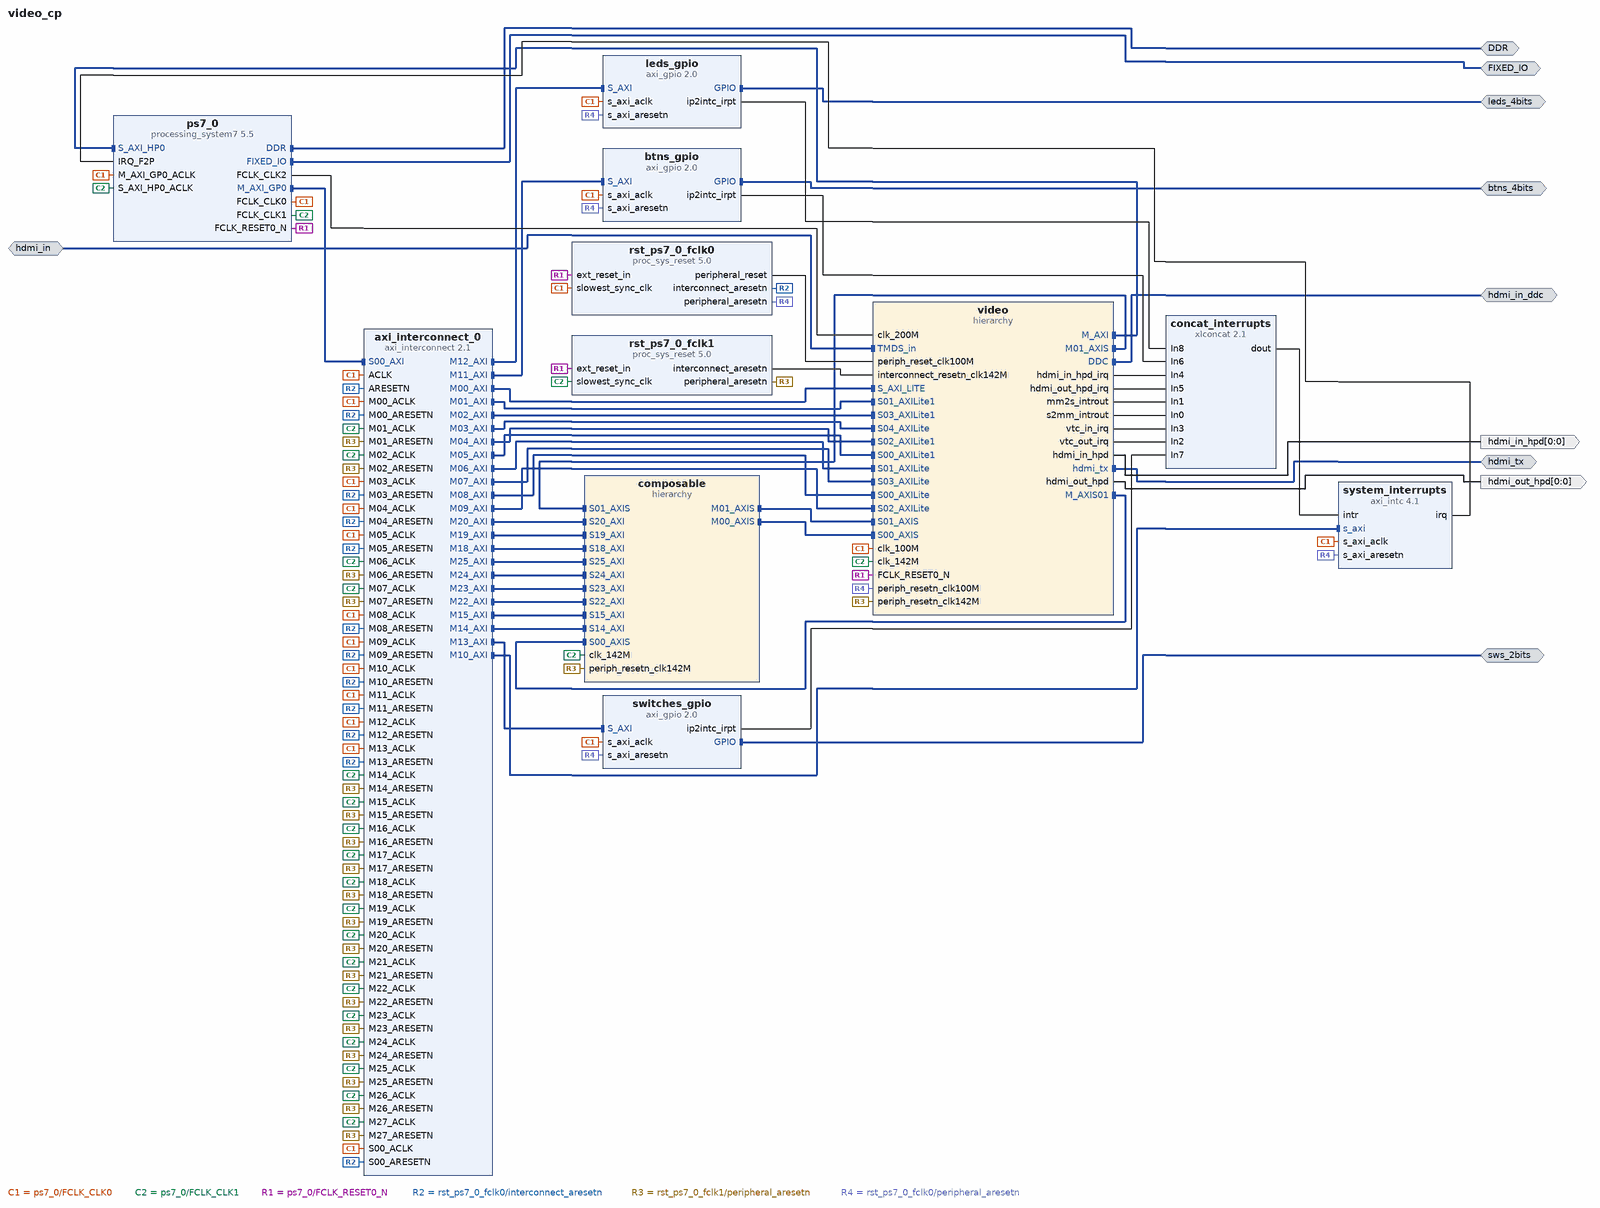
[diagram p0: block diagram of the top level]
# Vivado block design video_cp, xc7z020clg400-1, Vivado 2020.2.2
create_bd_design video_cp

create_bd_intf_port -mode Master -vlnv xilinx.com:interface:ddrx_rtl:1.0 DDR
create_bd_intf_port -mode Master -vlnv xilinx.com:display_processing_system7:fixedio_rtl:1.0 FIXED_IO
create_bd_intf_port -mode Master -vlnv xilinx.com:interface:gpio_rtl:1.0 btns_4bits
create_bd_intf_port -mode Slave -vlnv digilentinc.com:interface:tmds_rtl:1.0 hdmi_in
create_bd_intf_port -mode Master -vlnv xilinx.com:interface:iic_rtl:1.0 hdmi_in_ddc
create_bd_intf_port -mode Master -vlnv xilinx.com:interface:hdmi_rtl:2.0 hdmi_tx
create_bd_intf_port -mode Master -vlnv xilinx.com:interface:gpio_rtl:1.0 leds_4bits
create_bd_intf_port -mode Master -vlnv xilinx.com:interface:gpio_rtl:1.0 sws_2bits
create_bd_port -dir O -from 0 -to 0 hdmi_in_hpd
create_bd_port -dir O -from 0 -to 0 hdmi_out_hpd

create_bd_cell -type ip -vlnv xilinx.com:ip:axi_interconnect:2.1 axi_interconnect_0
set_property -dict [list \
  CONFIG.M00_HAS_REGSLICE 1 \
  CONFIG.M01_HAS_REGSLICE 1 \
  CONFIG.M02_HAS_REGSLICE 1 \
  CONFIG.M03_HAS_REGSLICE 1 \
  CONFIG.M04_HAS_REGSLICE 1 \
  CONFIG.M05_HAS_REGSLICE 1 \
  CONFIG.M06_HAS_REGSLICE 1 \
  CONFIG.M07_HAS_REGSLICE 1 \
  CONFIG.M08_HAS_REGSLICE 1 \
  CONFIG.M09_HAS_REGSLICE 1 \
  CONFIG.NUM_MI 28 \
  CONFIG.S00_HAS_REGSLICE 1 \
] [get_bd_cells axi_interconnect_0]
create_bd_cell -type ip -vlnv xilinx.com:ip:axi_gpio:2.0 btns_gpio
set_property -dict {CONFIG.C_ALL_INPUTS 1 CONFIG.C_GPIO_WIDTH 4 CONFIG.C_INTERRUPT_PRESENT 1} [get_bd_cells btns_gpio]
create_bd_cell -type hier composable
create_bd_cell -type ip -vlnv xilinx.com:ip:axi_gpio:2.0 leds_gpio
set_property -dict [list \
  CONFIG.C_ALL_OUTPUTS 1 \
  CONFIG.C_GPIO_WIDTH 4 \
  CONFIG.C_INTERRUPT_PRESENT 1 \
  CONFIG.C_IS_DUAL 0 \
] [get_bd_cells leds_gpio]
create_bd_cell -type ip -vlnv xilinx.com:ip:processing_system7:5.5 ps7_0
set_property -dict [list \
  CONFIG.PCW_APU_PERIPHERAL_FREQMHZ 650 \
  CONFIG.PCW_CRYSTAL_PERIPHERAL_FREQMHZ 50 \
  CONFIG.PCW_ENET0_ENET0_IO {MIO 16 .. 27} \
  CONFIG.PCW_ENET0_GRP_MDIO_ENABLE 1 \
  CONFIG.PCW_ENET0_GRP_MDIO_IO {MIO 52 .. 53} \
  CONFIG.PCW_ENET0_PERIPHERAL_ENABLE 1 \
  CONFIG.PCW_EN_CLK1_PORT 1 \
  CONFIG.PCW_EN_CLK2_PORT 1 \
  CONFIG.PCW_FCLK_CLK1_BUF TRUE \
  CONFIG.PCW_FCLK_CLK2_BUF TRUE \
  CONFIG.PCW_FPGA0_PERIPHERAL_FREQMHZ 100 \
  CONFIG.PCW_FPGA1_PERIPHERAL_FREQMHZ 142 \
  CONFIG.PCW_FPGA2_PERIPHERAL_FREQMHZ 200 \
  CONFIG.PCW_FPGA3_PERIPHERAL_FREQMHZ 100 \
  CONFIG.PCW_FPGA_FCLK1_ENABLE 1 \
  CONFIG.PCW_FPGA_FCLK2_ENABLE 1 \
  CONFIG.PCW_GPIO_MIO_GPIO_ENABLE 0 \
  CONFIG.PCW_I2C0_GRP_INT_ENABLE 1 \
  CONFIG.PCW_I2C0_GRP_INT_IO EMIO \
  CONFIG.PCW_I2C0_I2C0_IO {MIO 50 .. 51} \
  CONFIG.PCW_I2C0_PERIPHERAL_ENABLE 1 \
  CONFIG.PCW_I2C_PERIPHERAL_FREQMHZ 108.333336 \
  CONFIG.PCW_IRQ_F2P_INTR 1 \
  CONFIG.PCW_PERIPHERAL_BOARD_PRESET None \
  CONFIG.PCW_PRESET_BANK1_VOLTAGE {LVCMOS 1.8V} \
  CONFIG.PCW_QSPI_GRP_FBCLK_ENABLE 1 \
  CONFIG.PCW_QSPI_GRP_FBCLK_IO {MIO 8} \
  CONFIG.PCW_QSPI_GRP_SINGLE_SS_ENABLE 1 \
  CONFIG.PCW_QSPI_GRP_SINGLE_SS_IO {MIO 1 .. 6} \
  CONFIG.PCW_QSPI_PERIPHERAL_ENABLE 1 \
  CONFIG.PCW_QSPI_QSPI_IO {MIO 1 .. 6} \
  CONFIG.PCW_SD0_GRP_CD_ENABLE 1 \
  CONFIG.PCW_SD0_GRP_CD_IO {MIO 47} \
  CONFIG.PCW_SD0_GRP_WP_ENABLE 0 \
  CONFIG.PCW_SD0_PERIPHERAL_ENABLE 1 \
  CONFIG.PCW_SD0_SD0_IO {MIO 40 .. 45} \
  CONFIG.PCW_SDIO_PERIPHERAL_FREQMHZ 50 \
  CONFIG.PCW_SINGLE_QSPI_DATA_MODE x4 \
  CONFIG.PCW_UART0_PERIPHERAL_ENABLE 1 \
  CONFIG.PCW_UART0_UART0_IO {MIO 14 .. 15} \
  CONFIG.PCW_UART1_PERIPHERAL_ENABLE 0 \
  CONFIG.PCW_UART_PERIPHERAL_FREQMHZ 100 \
  CONFIG.PCW_UIPARAM_DDR_BUS_WIDTH {16 Bit} \
  CONFIG.PCW_UIPARAM_DDR_FREQ_MHZ 525 \
  CONFIG.PCW_UIPARAM_DDR_PARTNO Custom \
  CONFIG.PCW_USB0_PERIPHERAL_ENABLE 1 \
  CONFIG.PCW_USB0_USB0_IO {MIO 28 .. 39} \
  CONFIG.PCW_USE_FABRIC_INTERRUPT 1 \
  CONFIG.PCW_USE_S_AXI_HP0 1 \
] [get_bd_cells ps7_0]
# 481 more settings of ps7_0 are not shown: defaults, MIO pin electricals, DDR timing, and values the tool derives
create_bd_cell -type ip -vlnv xilinx.com:ip:proc_sys_reset:5.0 rst_ps7_0_fclk0
create_bd_cell -type ip -vlnv xilinx.com:ip:proc_sys_reset:5.0 rst_ps7_0_fclk1
create_bd_cell -type ip -vlnv xilinx.com:ip:axi_gpio:2.0 switches_gpio
set_property -dict [list \
  CONFIG.C_ALL_INPUTS 1 \
  CONFIG.C_GPIO_WIDTH 2 \
  CONFIG.C_INTERRUPT_PRESENT 1 \
  CONFIG.C_IS_DUAL 0 \
] [get_bd_cells switches_gpio]
create_bd_cell -type ip -vlnv xilinx.com:ip:axi_intc:4.1 system_interrupts
create_bd_cell -type hier video
create_bd_cell -type ip -vlnv xilinx.com:ip:xlconcat:2.1 concat_interrupts
set_property -dict {CONFIG.NUM_PORTS 9} [get_bd_cells concat_interrupts]

# ---- hierarchy /composable ----
current_bd_instance /composable
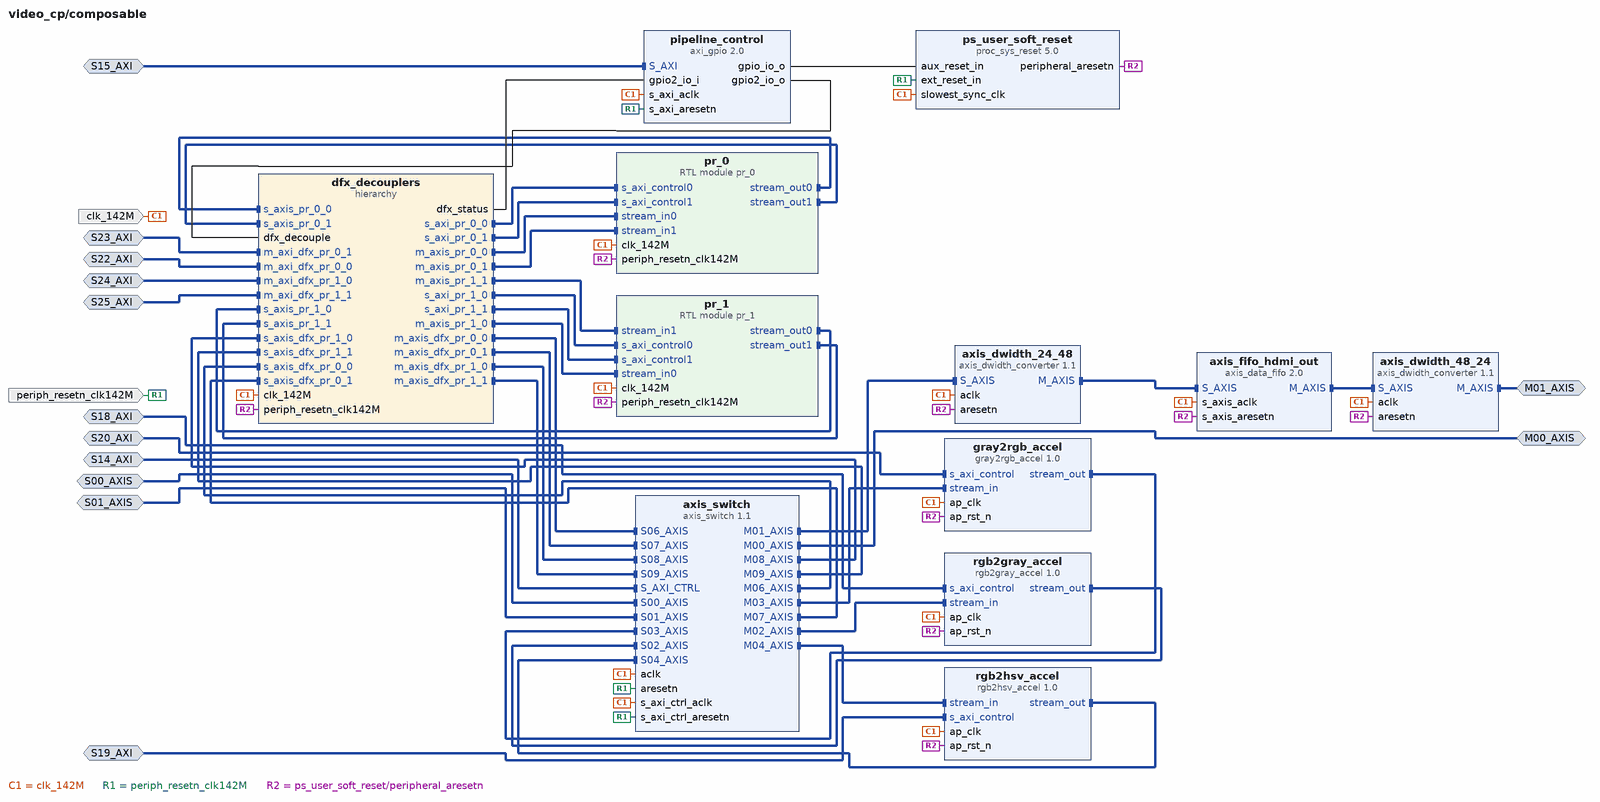
[diagram p1: block diagram inside /composable]
create_bd_intf_pin -mode Master -vlnv xilinx.com:interface:axis_rtl:1.0 M00_AXIS
create_bd_intf_pin -mode Master -vlnv xilinx.com:interface:axis_rtl:1.0 M01_AXIS
create_bd_intf_pin -mode Slave -vlnv xilinx.com:interface:axis_rtl:1.0 S00_AXIS
create_bd_intf_pin -mode Slave -vlnv xilinx.com:interface:axis_rtl:1.0 S01_AXIS
create_bd_intf_pin -mode Slave -vlnv xilinx.com:interface:aximm_rtl:1.0 S14_AXI
create_bd_intf_pin -mode Slave -vlnv xilinx.com:interface:aximm_rtl:1.0 S15_AXI
create_bd_intf_pin -mode Slave -vlnv xilinx.com:interface:aximm_rtl:1.0 S18_AXI
create_bd_intf_pin -mode Slave -vlnv xilinx.com:interface:aximm_rtl:1.0 S19_AXI
create_bd_intf_pin -mode Slave -vlnv xilinx.com:interface:aximm_rtl:1.0 S20_AXI
create_bd_intf_pin -mode Slave -vlnv xilinx.com:interface:aximm_rtl:1.0 S22_AXI
create_bd_intf_pin -mode Slave -vlnv xilinx.com:interface:aximm_rtl:1.0 S23_AXI
create_bd_intf_pin -mode Slave -vlnv xilinx.com:interface:aximm_rtl:1.0 S24_AXI
create_bd_intf_pin -mode Slave -vlnv xilinx.com:interface:aximm_rtl:1.0 S25_AXI
create_bd_pin -dir I clk_142M
create_bd_pin -dir I -type rst periph_resetn_clk142M

create_bd_cell -type ip -vlnv xilinx.com:ip:axis_dwidth_converter:1.1 axis_dwidth_24_48
set_property -dict [list \
  CONFIG.HAS_MI_TKEEP 1 \
  CONFIG.HAS_TKEEP 0 \
  CONFIG.HAS_TLAST 1 \
  CONFIG.HAS_TSTRB 0 \
  CONFIG.M_TDATA_NUM_BYTES 6 \
  CONFIG.S_TDATA_NUM_BYTES 3 \
  CONFIG.TDEST_WIDTH 0 \
  CONFIG.TID_WIDTH 0 \
  CONFIG.TUSER_BITS_PER_BYTE 1 \
] [get_bd_cells axis_dwidth_24_48]
create_bd_cell -type ip -vlnv xilinx.com:ip:axis_dwidth_converter:1.1 axis_dwidth_48_24
set_property -dict [list \
  CONFIG.HAS_TKEEP 0 \
  CONFIG.HAS_TLAST 1 \
  CONFIG.HAS_TSTRB 0 \
  CONFIG.M_TDATA_NUM_BYTES 3 \
  CONFIG.S_TDATA_NUM_BYTES 6 \
  CONFIG.TDEST_WIDTH 0 \
  CONFIG.TID_WIDTH 0 \
  CONFIG.TUSER_BITS_PER_BYTE 1 \
] [get_bd_cells axis_dwidth_48_24]
create_bd_cell -type ip -vlnv xilinx.com:ip:axis_data_fifo:2.0 axis_fifo_hdmi_out
set_property -dict [list \
  CONFIG.FIFO_DEPTH 4096 \
  CONFIG.FIFO_MEMORY_TYPE block \
  CONFIG.HAS_TLAST 1 \
  CONFIG.TDATA_NUM_BYTES 6 \
  CONFIG.TUSER_WIDTH 1 \
] [get_bd_cells axis_fifo_hdmi_out]
create_bd_cell -type ip -vlnv xilinx.com:ip:axis_switch:1.1 axis_switch
set_property -dict [list \
  CONFIG.DECODER_REG 1 \
  CONFIG.HAS_TKEEP 0 \
  CONFIG.HAS_TLAST 1 \
  CONFIG.HAS_TREADY 1 \
  CONFIG.HAS_TSTRB 0 \
  CONFIG.NUM_MI 15 \
  CONFIG.NUM_SI 15 \
  CONFIG.ROUTING_MODE 1 \
  CONFIG.TDATA_NUM_BYTES 3 \
  CONFIG.TDEST_WIDTH 0 \
  CONFIG.TID_WIDTH 0 \
  CONFIG.TUSER_WIDTH 1 \
] [get_bd_cells axis_switch]
create_bd_cell -type hier dfx_decouplers
create_bd_cell -type ip -vlnv xilinx.com:hls:gray2rgb_accel:1.0 gray2rgb_accel
create_bd_cell -type ip -vlnv xilinx.com:ip:axi_gpio:2.0 pipeline_control
set_property -dict [list \
  CONFIG.C_ALL_INPUTS_2 0 \
  CONFIG.C_ALL_OUTPUTS 1 \
  CONFIG.C_GPIO2_WIDTH 8 \
  CONFIG.C_GPIO_WIDTH 1 \
  CONFIG.C_IS_DUAL 1 \
] [get_bd_cells pipeline_control]
create_bd_cell -type ip -vlnv xilinx.com:ip:proc_sys_reset:5.0 ps_user_soft_reset
set_property -dict {CONFIG.C_AUX_RESET_HIGH 1} [get_bd_cells ps_user_soft_reset]
create_bd_cell -type ip -vlnv xilinx.com:hls:rgb2gray_accel:1.0 rgb2gray_accel
create_bd_cell -type ip -vlnv xilinx.com:hls:rgb2hsv_accel:1.0 rgb2hsv_accel
create_bd_cell -type module -reference pr_0 pr_0
create_bd_cell -type module -reference pr_1 pr_1

# ---- hierarchy /composable/dfx_decouplers ----
current_bd_instance /composable/dfx_decouplers
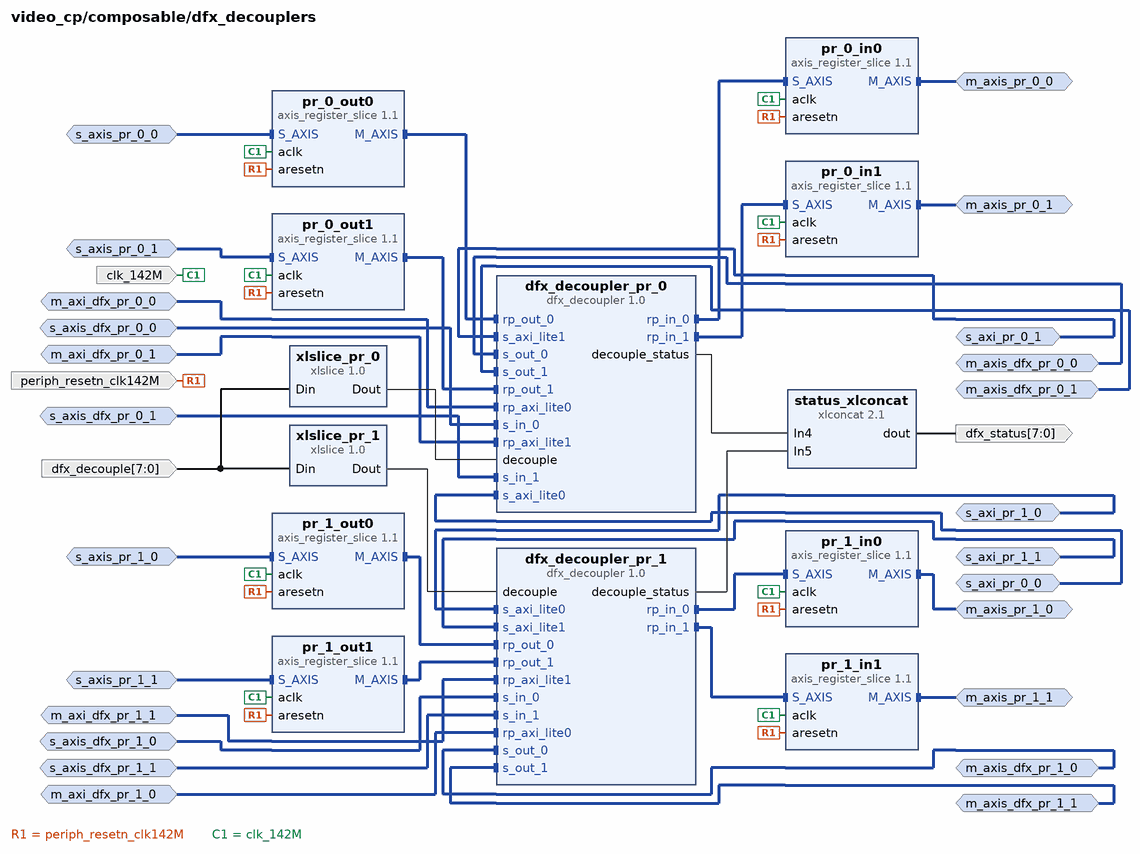
[diagram p2: block diagram inside /composable/dfx_decouplers]
create_bd_intf_pin -mode Slave -vlnv xilinx.com:interface:aximm_rtl:1.0 m_axi_dfx_pr_0_0
create_bd_intf_pin -mode Slave -vlnv xilinx.com:interface:aximm_rtl:1.0 m_axi_dfx_pr_0_1
create_bd_intf_pin -mode Slave -vlnv xilinx.com:interface:aximm_rtl:1.0 m_axi_dfx_pr_1_0
create_bd_intf_pin -mode Slave -vlnv xilinx.com:interface:aximm_rtl:1.0 m_axi_dfx_pr_1_1
create_bd_intf_pin -mode Master -vlnv xilinx.com:interface:axis_rtl:1.0 m_axis_dfx_pr_0_0
create_bd_intf_pin -mode Master -vlnv xilinx.com:interface:axis_rtl:1.0 m_axis_dfx_pr_0_1
create_bd_intf_pin -mode Master -vlnv xilinx.com:interface:axis_rtl:1.0 m_axis_dfx_pr_1_0
create_bd_intf_pin -mode Master -vlnv xilinx.com:interface:axis_rtl:1.0 m_axis_dfx_pr_1_1
create_bd_intf_pin -mode Master -vlnv xilinx.com:interface:axis_rtl:1.0 m_axis_pr_0_0
create_bd_intf_pin -mode Master -vlnv xilinx.com:interface:axis_rtl:1.0 m_axis_pr_0_1
create_bd_intf_pin -mode Master -vlnv xilinx.com:interface:axis_rtl:1.0 m_axis_pr_1_0
create_bd_intf_pin -mode Master -vlnv xilinx.com:interface:axis_rtl:1.0 m_axis_pr_1_1
create_bd_intf_pin -mode Master -vlnv xilinx.com:interface:aximm_rtl:1.0 s_axi_pr_0_0
create_bd_intf_pin -mode Master -vlnv xilinx.com:interface:aximm_rtl:1.0 s_axi_pr_0_1
create_bd_intf_pin -mode Master -vlnv xilinx.com:interface:aximm_rtl:1.0 s_axi_pr_1_0
create_bd_intf_pin -mode Master -vlnv xilinx.com:interface:aximm_rtl:1.0 s_axi_pr_1_1
create_bd_intf_pin -mode Slave -vlnv xilinx.com:interface:axis_rtl:1.0 s_axis_dfx_pr_0_0
create_bd_intf_pin -mode Slave -vlnv xilinx.com:interface:axis_rtl:1.0 s_axis_dfx_pr_0_1
create_bd_intf_pin -mode Slave -vlnv xilinx.com:interface:axis_rtl:1.0 s_axis_dfx_pr_1_0
create_bd_intf_pin -mode Slave -vlnv xilinx.com:interface:axis_rtl:1.0 s_axis_dfx_pr_1_1
create_bd_intf_pin -mode Slave -vlnv xilinx.com:interface:axis_rtl:1.0 s_axis_pr_0_0
create_bd_intf_pin -mode Slave -vlnv xilinx.com:interface:axis_rtl:1.0 s_axis_pr_0_1
create_bd_intf_pin -mode Slave -vlnv xilinx.com:interface:axis_rtl:1.0 s_axis_pr_1_0
create_bd_intf_pin -mode Slave -vlnv xilinx.com:interface:axis_rtl:1.0 s_axis_pr_1_1
create_bd_pin -dir I -type clk clk_142M
create_bd_pin -dir I -from 7 -to 0 dfx_decouple
create_bd_pin -dir O -from 7 -to 0 dfx_status
create_bd_pin -dir I -type rst periph_resetn_clk142M

create_bd_cell -type ip -vlnv xilinx.com:ip:dfx_decoupler:1.0 dfx_decoupler_pr_0
set_property -dict [list \
  CONFIG.ALL_PARAMS {INTF {in_0 {ID 0 MODE slave VLNV xilinx.com:interface:axis_rtl:1.0 SIGNALS {TVALID {PRESENT 1 WIDTH 1} TREADY {PRESENT 1 WIDTH 1} TDATA {PRESENT 1 WIDTH 24} TUSER {PRESENT 1 WIDTH 1} TLAST {PRESENT 1 WIDTH 1} TID {PRESENT 0 WIDTH 0} TDEST {PRESENT 0 WIDTH 0} TSTRB {PRESENT 0 WIDTH 3} TKEEP {PRESENT 0 WIDTH 3}}} in_1 {ID 1 MODE slave VLNV xilinx.com:interface:axis_rtl:1.0 SIGNALS {TVALID {PRESENT 1 WIDTH 1} TREADY {PRESENT 1 WIDTH 1} TDATA {PRESENT 1 WIDTH 24} TUSER {PRESENT 1 WIDTH 1} TLAST {PRESENT 1 WIDTH 1} TID {PRESENT 0 WIDTH 0} TDEST {PRESENT 0 WIDTH 0} TSTRB {PRESENT 0 WIDTH 3} TKEEP {PRESENT 0 WIDTH 3}}} out_0 {ID 2 VLNV xilinx.com:interface:axis_rtl:1.0 SIGNALS {TVALID {PRESENT 1 WIDTH 1} TREADY {PRESENT 1 WIDTH 1} TDATA {PRESENT 1 WIDTH 24 MANAGEMENT manual} TUSER {PRESENT 1 WIDTH 1} TLAST {PRESENT 1 WIDTH 1} TID {PRESENT 1 WIDTH 1} TDEST {PRESENT 1 WIDTH 1} TSTRB {PRESENT 0 WIDTH 3} TKEEP {PRESENT 0 WIDTH 3}}} out_1 {ID 3 VLNV xilinx.com:interface:axis_rtl:1.0 SIGNALS {TVALID {PRESENT 1 WIDTH 1} TREADY {PRESENT 1 WIDTH 1} TDATA {PRESENT 1 WIDTH 24} TUSER {PRESENT 1 WIDTH 1} TLAST {PRESENT 1 WIDTH 1} TID {PRESENT 1 WIDTH 1} TDEST {PRESENT 1 WIDTH 1} TSTRB {PRESENT 0 WIDTH 3} TKEEP {PRESENT 0 WIDTH 3}}} axi_lite0 {ID 4 VLNV xilinx.com:interface:aximm_rtl:1.0 PROTOCOL axi4lite SIGNALS {ARVALID {PRESENT 1 WIDTH 1} ARREADY {PRESENT 1 WIDTH 1} AWVALID {PRESENT 1 WIDTH 1} AWREADY {PRESENT 1 WIDTH 1} BVALID {PRESENT 1 WIDTH 1} BREADY {PRESENT 1 WIDTH 1} RVALID {PRESENT 1 WIDTH 1} RREADY {PRESENT 1 WIDTH 1} WVALID {PRESENT 1 WIDTH 1} WREADY {PRESENT 1 WIDTH 1} AWADDR {PRESENT 1 WIDTH 31} AWLEN {PRESENT 0 WIDTH 8} AWSIZE {PRESENT 0 WIDTH 3} AWBURST {PRESENT 0 WIDTH 2} AWLOCK {PRESENT 0 WIDTH 1} AWCACHE {PRESENT 0 WIDTH 4} AWPROT {PRESENT 1 WIDTH 3} WDATA {PRESENT 1 WIDTH 32} WSTRB {PRESENT 1 WIDTH 4} WLAST {PRESENT 0 WIDTH 1} BRESP {PRESENT 1 WIDTH 2} ARADDR {PRESENT 1 WIDTH 31} ARLEN {PRESENT 0 WIDTH 8} ARSIZE {PRESENT 0 WIDTH 3} ARBURST {PRESENT 0 WIDTH 2} ARLOCK {PRESENT 0 WIDTH 1} ARCACHE {PRESENT 0 WIDTH 4} ARPROT {PRESENT 1 WIDTH 3} RDATA {PRESENT 1 WIDTH 32} RRESP {PRESENT 1 WIDTH 2} RLAST {PRESENT 0 WIDTH 1} AWID {PRESENT 0 WIDTH 0} AWREGION {PRESENT 1 WIDTH 4} AWQOS {PRESENT 1 WIDTH 4} AWUSER {PRESENT 0 WIDTH 0} WID {PRESENT 0 WIDTH 0} WUSER {PRESENT 0 WIDTH 0} BID {PRESENT 0 WIDTH 0} BUSER {PRESENT 0 WIDTH 0} ARID {PRESENT 0 WIDTH 0} ARREGION {PRESENT 1 WIDTH 4} ARQOS {PRESENT 1 WIDTH 4} ARUSER {PRESENT 0 WIDTH 0} RID {PRESENT 0 WIDTH 0} RUSER {PRESENT 0 WIDTH 0}}} axi_lite1 {ID 5 VLNV xilinx.com:interface:aximm_rtl:1.0 PROTOCOL axi4lite SIGNALS {ARVALID {PRESENT 1 WIDTH 1} ARREADY {PRESENT 1 WIDTH 1} AWVALID {PRESENT 1 WIDTH 1} AWREADY {PRESENT 1 WIDTH 1} BVALID {PRESENT 1 WIDTH 1} BREADY {PRESENT 1 WIDTH 1} RVALID {PRESENT 1 WIDTH 1} RREADY {PRESENT 1 WIDTH 1} WVALID {PRESENT 1 WIDTH 1} WREADY {PRESENT 1 WIDTH 1} AWADDR {PRESENT 1 WIDTH 31} AWLEN {PRESENT 0 WIDTH 8} AWSIZE {PRESENT 0 WIDTH 3} AWBURST {PRESENT 0 WIDTH 2} AWLOCK {PRESENT 0 WIDTH 1} AWCACHE {PRESENT 0 WIDTH 4} AWPROT {PRESENT 1 WIDTH 3} WDATA {PRESENT 1 WIDTH 32} WSTRB {PRESENT 1 WIDTH 4} WLAST {PRESENT 0 WIDTH 1} BRESP {PRESENT 1 WIDTH 2} ARADDR {PRESENT 1 WIDTH 31} ARLEN {PRESENT 0 WIDTH 8} ARSIZE {PRESENT 0 WIDTH 3} ARBURST {PRESENT 0 WIDTH 2} ARLOCK {PRESENT 0 WIDTH 1} ARCACHE {PRESENT 0 WIDTH 4} ARPROT {PRESENT 1 WIDTH 3} RDATA {PRESENT 1 WIDTH 32} RRESP {PRESENT 1 WIDTH 2} RLAST {PRESENT 0 WIDTH 1} AWID {PRESENT 0 WIDTH 0} AWREGION {PRESENT 1 WIDTH 4} AWQOS {PRESENT 1 WIDTH 4} AWUSER {PRESENT 0 WIDTH 0} WID {PRESENT 0 WIDTH 0} WUSER {PRESENT 0 WIDTH 0} BID {PRESENT 0 WIDTH 0} BUSER {PRESENT 0 WIDTH 0} ARID {PRESENT 0 WIDTH 0} ARREGION {PRESENT 1 WIDTH 4} ARQOS {PRESENT 1 WIDTH 4} ARUSER {PRESENT 0 WIDTH 0} RID {PRESENT 0 WIDTH 0} RUSER {PRESENT 0 WIDTH 0}}}} IPI_PROP_COUNT 29} \
  CONFIG.GUI_INTERFACE_NAME in_0 \
  CONFIG.GUI_SELECT_INTERFACE 0 \
  CONFIG.GUI_SELECT_MODE slave \
  CONFIG.GUI_SELECT_VLNV xilinx.com:interface:axis_rtl:1.0 \
  CONFIG.GUI_SIGNAL_DECOUPLED_0 true \
  CONFIG.GUI_SIGNAL_DECOUPLED_1 true \
  CONFIG.GUI_SIGNAL_DECOUPLED_2 false \
  CONFIG.GUI_SIGNAL_DECOUPLED_3 false \
  CONFIG.GUI_SIGNAL_DECOUPLED_4 false \
  CONFIG.GUI_SIGNAL_MANAGEMENT_2 auto \
  CONFIG.GUI_SIGNAL_SELECT_0 TVALID \
  CONFIG.GUI_SIGNAL_SELECT_1 TREADY \
  CONFIG.GUI_SIGNAL_SELECT_2 TDATA \
  CONFIG.GUI_SIGNAL_SELECT_3 TUSER \
  CONFIG.GUI_SIGNAL_SELECT_4 TLAST \
  CONFIG.GUI_SIGNAL_SELECT_5 TID \
  CONFIG.GUI_SIGNAL_SELECT_6 TDEST \
  CONFIG.GUI_SIGNAL_SELECT_7 TSTRB \
  CONFIG.GUI_SIGNAL_SELECT_8 TKEEP \
] [get_bd_cells dfx_decoupler_pr_0]
create_bd_cell -type ip -vlnv xilinx.com:ip:dfx_decoupler:1.0 dfx_decoupler_pr_1
set_property -dict [list \
  CONFIG.ALL_PARAMS {INTF {in_0 {ID 0 MODE slave VLNV xilinx.com:interface:axis_rtl:1.0 SIGNALS {TVALID {PRESENT 1 WIDTH 1} TREADY {PRESENT 1 WIDTH 1} TDATA {PRESENT 1 WIDTH 24} TUSER {PRESENT 1 WIDTH 1} TLAST {PRESENT 1 WIDTH 1} TID {PRESENT 0 WIDTH 0} TDEST {PRESENT 0 WIDTH 0} TSTRB {PRESENT 0 WIDTH 3} TKEEP {PRESENT 0 WIDTH 3}}} in_1 {ID 1 MODE slave VLNV xilinx.com:interface:axis_rtl:1.0 SIGNALS {TVALID {PRESENT 1 WIDTH 1} TREADY {PRESENT 1 WIDTH 1} TDATA {PRESENT 1 WIDTH 24} TUSER {PRESENT 1 WIDTH 1} TLAST {PRESENT 1 WIDTH 1} TID {PRESENT 0 WIDTH 0} TDEST {PRESENT 0 WIDTH 0} TSTRB {PRESENT 0 WIDTH 3} TKEEP {PRESENT 0 WIDTH 3}}} out_0 {ID 2 VLNV xilinx.com:interface:axis_rtl:1.0 SIGNALS {TVALID {PRESENT 1 WIDTH 1} TREADY {PRESENT 1 WIDTH 1} TDATA {PRESENT 1 WIDTH 24} TUSER {PRESENT 1 WIDTH 1} TLAST {PRESENT 1 WIDTH 1} TID {PRESENT 1 WIDTH 1} TDEST {PRESENT 1 WIDTH 1} TSTRB {PRESENT 0 WIDTH 3} TKEEP {PRESENT 0 WIDTH 3}}} out_1 {ID 3 VLNV xilinx.com:interface:axis_rtl:1.0 SIGNALS {TVALID {PRESENT 1 WIDTH 1} TREADY {PRESENT 1 WIDTH 1} TDATA {PRESENT 1 WIDTH 24} TUSER {PRESENT 1 WIDTH 1} TLAST {PRESENT 1 WIDTH 1} TID {PRESENT 1 WIDTH 1} TDEST {PRESENT 1 WIDTH 1} TSTRB {PRESENT 0 WIDTH 3} TKEEP {PRESENT 0 WIDTH 3}}} axi_lite0 {ID 4 VLNV xilinx.com:interface:aximm_rtl:1.0 PROTOCOL axi4lite SIGNALS {ARVALID {PRESENT 1 WIDTH 1} ARREADY {PRESENT 1 WIDTH 1} AWVALID {PRESENT 1 WIDTH 1} AWREADY {PRESENT 1 WIDTH 1} BVALID {PRESENT 1 WIDTH 1} BREADY {PRESENT 1 WIDTH 1} RVALID {PRESENT 1 WIDTH 1} RREADY {PRESENT 1 WIDTH 1} WVALID {PRESENT 1 WIDTH 1} WREADY {PRESENT 1 WIDTH 1} AWADDR {PRESENT 1 WIDTH 31} AWLEN {PRESENT 0 WIDTH 8} AWSIZE {PRESENT 0 WIDTH 3} AWBURST {PRESENT 0 WIDTH 2} AWLOCK {PRESENT 0 WIDTH 1} AWCACHE {PRESENT 0 WIDTH 4} AWPROT {PRESENT 1 WIDTH 3} WDATA {PRESENT 1 WIDTH 32} WSTRB {PRESENT 1 WIDTH 4} WLAST {PRESENT 0 WIDTH 1} BRESP {PRESENT 1 WIDTH 2} ARADDR {PRESENT 1 WIDTH 31} ARLEN {PRESENT 0 WIDTH 8} ARSIZE {PRESENT 0 WIDTH 3} ARBURST {PRESENT 0 WIDTH 2} ARLOCK {PRESENT 0 WIDTH 1} ARCACHE {PRESENT 0 WIDTH 4} ARPROT {PRESENT 1 WIDTH 3} RDATA {PRESENT 1 WIDTH 32} RRESP {PRESENT 1 WIDTH 2} RLAST {PRESENT 0 WIDTH 1} AWID {PRESENT 0 WIDTH 0} AWREGION {PRESENT 1 WIDTH 4} AWQOS {PRESENT 1 WIDTH 4} AWUSER {PRESENT 0 WIDTH 0} WID {PRESENT 0 WIDTH 0} WUSER {PRESENT 0 WIDTH 0} BID {PRESENT 0 WIDTH 0} BUSER {PRESENT 0 WIDTH 0} ARID {PRESENT 0 WIDTH 0} ARREGION {PRESENT 1 WIDTH 4} ARQOS {PRESENT 1 WIDTH 4} ARUSER {PRESENT 0 WIDTH 0} RID {PRESENT 0 WIDTH 0} RUSER {PRESENT 0 WIDTH 0}}} axi_lite1 {ID 5 VLNV xilinx.com:interface:aximm_rtl:1.0 PROTOCOL axi4lite SIGNALS {ARVALID {PRESENT 1 WIDTH 1} ARREADY {PRESENT 1 WIDTH 1} AWVALID {PRESENT 1 WIDTH 1} AWREADY {PRESENT 1 WIDTH 1} BVALID {PRESENT 1 WIDTH 1} BREADY {PRESENT 1 WIDTH 1} RVALID {PRESENT 1 WIDTH 1} RREADY {PRESENT 1 WIDTH 1} WVALID {PRESENT 1 WIDTH 1} WREADY {PRESENT 1 WIDTH 1} AWADDR {PRESENT 1 WIDTH 31} AWLEN {PRESENT 0 WIDTH 8} AWSIZE {PRESENT 0 WIDTH 3} AWBURST {PRESENT 0 WIDTH 2} AWLOCK {PRESENT 0 WIDTH 1} AWCACHE {PRESENT 0 WIDTH 4} AWPROT {PRESENT 1 WIDTH 3} WDATA {PRESENT 1 WIDTH 32} WSTRB {PRESENT 1 WIDTH 4} WLAST {PRESENT 0 WIDTH 1} BRESP {PRESENT 1 WIDTH 2} ARADDR {PRESENT 1 WIDTH 31} ARLEN {PRESENT 0 WIDTH 8} ARSIZE {PRESENT 0 WIDTH 3} ARBURST {PRESENT 0 WIDTH 2} ARLOCK {PRESENT 0 WIDTH 1} ARCACHE {PRESENT 0 WIDTH 4} ARPROT {PRESENT 1 WIDTH 3} RDATA {PRESENT 1 WIDTH 32} RRESP {PRESENT 1 WIDTH 2} RLAST {PRESENT 0 WIDTH 1} AWID {PRESENT 0 WIDTH 0} AWREGION {PRESENT 1 WIDTH 4} AWQOS {PRESENT 1 WIDTH 4} AWUSER {PRESENT 0 WIDTH 0} WID {PRESENT 0 WIDTH 0} WUSER {PRESENT 0 WIDTH 0} BID {PRESENT 0 WIDTH 0} BUSER {PRESENT 0 WIDTH 0} ARID {PRESENT 0 WIDTH 0} ARREGION {PRESENT 1 WIDTH 4} ARQOS {PRESENT 1 WIDTH 4} ARUSER {PRESENT 0 WIDTH 0} RID {PRESENT 0 WIDTH 0} RUSER {PRESENT 0 WIDTH 0}}}} IPI_PROP_COUNT 22} \
  CONFIG.GUI_INTERFACE_NAME in_0 \
  CONFIG.GUI_SELECT_INTERFACE 0 \
  CONFIG.GUI_SELECT_MODE slave \
  CONFIG.GUI_SELECT_VLNV xilinx.com:interface:axis_rtl:1.0 \
  CONFIG.GUI_SIGNAL_DECOUPLED_0 true \
  CONFIG.GUI_SIGNAL_DECOUPLED_1 true \
  CONFIG.GUI_SIGNAL_DECOUPLED_2 false \
  CONFIG.GUI_SIGNAL_DECOUPLED_3 false \
  CONFIG.GUI_SIGNAL_DECOUPLED_4 false \
  CONFIG.GUI_SIGNAL_SELECT_0 TVALID \
  CONFIG.GUI_SIGNAL_SELECT_1 TREADY \
  CONFIG.GUI_SIGNAL_SELECT_2 TDATA \
  CONFIG.GUI_SIGNAL_SELECT_3 TUSER \
  CONFIG.GUI_SIGNAL_SELECT_4 TLAST \
  CONFIG.GUI_SIGNAL_SELECT_5 TID \
  CONFIG.GUI_SIGNAL_SELECT_6 TDEST \
  CONFIG.GUI_SIGNAL_SELECT_7 TSTRB \
  CONFIG.GUI_SIGNAL_SELECT_8 TKEEP \
] [get_bd_cells dfx_decoupler_pr_1]
create_bd_cell -type ip -vlnv xilinx.com:ip:axis_register_slice:1.1 pr_0_in0
set_property -dict [list \
  CONFIG.HAS_TKEEP 0 \
  CONFIG.HAS_TLAST 1 \
  CONFIG.HAS_TSTRB 0 \
  CONFIG.REG_CONFIG 8 \
  CONFIG.TDATA_NUM_BYTES 3 \
  CONFIG.TUSER_WIDTH 1 \
] [get_bd_cells pr_0_in0]
create_bd_cell -type ip -vlnv xilinx.com:ip:axis_register_slice:1.1 pr_0_in1
set_property -dict [list \
  CONFIG.HAS_TKEEP 0 \
  CONFIG.HAS_TLAST 1 \
  CONFIG.HAS_TSTRB 0 \
  CONFIG.REG_CONFIG 8 \
  CONFIG.TDATA_NUM_BYTES 3 \
  CONFIG.TUSER_WIDTH 1 \
] [get_bd_cells pr_0_in1]
create_bd_cell -type ip -vlnv xilinx.com:ip:axis_register_slice:1.1 pr_0_out0
set_property -dict [list \
  CONFIG.HAS_TKEEP 0 \
  CONFIG.HAS_TLAST 1 \
  CONFIG.HAS_TSTRB 0 \
  CONFIG.REG_CONFIG 8 \
  CONFIG.TDATA_NUM_BYTES 3 \
  CONFIG.TUSER_WIDTH 1 \
] [get_bd_cells pr_0_out0]
create_bd_cell -type ip -vlnv xilinx.com:ip:axis_register_slice:1.1 pr_0_out1
set_property -dict [list \
  CONFIG.HAS_TKEEP 0 \
  CONFIG.HAS_TLAST 1 \
  CONFIG.HAS_TSTRB 0 \
  CONFIG.REG_CONFIG 8 \
  CONFIG.TDATA_NUM_BYTES 3 \
  CONFIG.TUSER_WIDTH 1 \
] [get_bd_cells pr_0_out1]
create_bd_cell -type ip -vlnv xilinx.com:ip:axis_register_slice:1.1 pr_1_in0
set_property -dict [list \
  CONFIG.HAS_TKEEP 0 \
  CONFIG.HAS_TLAST 1 \
  CONFIG.HAS_TSTRB 0 \
  CONFIG.REG_CONFIG 8 \
  CONFIG.TDATA_NUM_BYTES 3 \
  CONFIG.TUSER_WIDTH 1 \
] [get_bd_cells pr_1_in0]
create_bd_cell -type ip -vlnv xilinx.com:ip:axis_register_slice:1.1 pr_1_in1
set_property -dict [list \
  CONFIG.HAS_TKEEP 0 \
  CONFIG.HAS_TLAST 1 \
  CONFIG.HAS_TSTRB 0 \
  CONFIG.REG_CONFIG 8 \
  CONFIG.TDATA_NUM_BYTES 3 \
  CONFIG.TUSER_WIDTH 1 \
] [get_bd_cells pr_1_in1]
create_bd_cell -type ip -vlnv xilinx.com:ip:axis_register_slice:1.1 pr_1_out0
set_property -dict [list \
  CONFIG.HAS_TKEEP 0 \
  CONFIG.HAS_TLAST 1 \
  CONFIG.HAS_TSTRB 0 \
  CONFIG.REG_CONFIG 8 \
  CONFIG.TDATA_NUM_BYTES 3 \
  CONFIG.TUSER_WIDTH 1 \
] [get_bd_cells pr_1_out0]
create_bd_cell -type ip -vlnv xilinx.com:ip:axis_register_slice:1.1 pr_1_out1
set_property -dict [list \
  CONFIG.HAS_TKEEP 0 \
  CONFIG.HAS_TLAST 1 \
  CONFIG.HAS_TSTRB 0 \
  CONFIG.REG_CONFIG 8 \
  CONFIG.TDATA_NUM_BYTES 3 \
  CONFIG.TUSER_WIDTH 1 \
] [get_bd_cells pr_1_out1]
create_bd_cell -type ip -vlnv xilinx.com:ip:xlconcat:2.1 status_xlconcat
set_property -dict {CONFIG.NUM_PORTS 8} [get_bd_cells status_xlconcat]
create_bd_cell -type ip -vlnv xilinx.com:ip:xlslice:1.0 xlslice_pr_0
set_property -dict {CONFIG.DIN_WIDTH 8} [get_bd_cells xlslice_pr_0]
create_bd_cell -type ip -vlnv xilinx.com:ip:xlslice:1.0 xlslice_pr_1
set_property -dict {CONFIG.DIN_FROM 1 CONFIG.DIN_TO 1 CONFIG.DIN_WIDTH 8 CONFIG.DOUT_WIDTH 1} [get_bd_cells xlslice_pr_1]

# ---- hierarchy /video ----
current_bd_instance /video
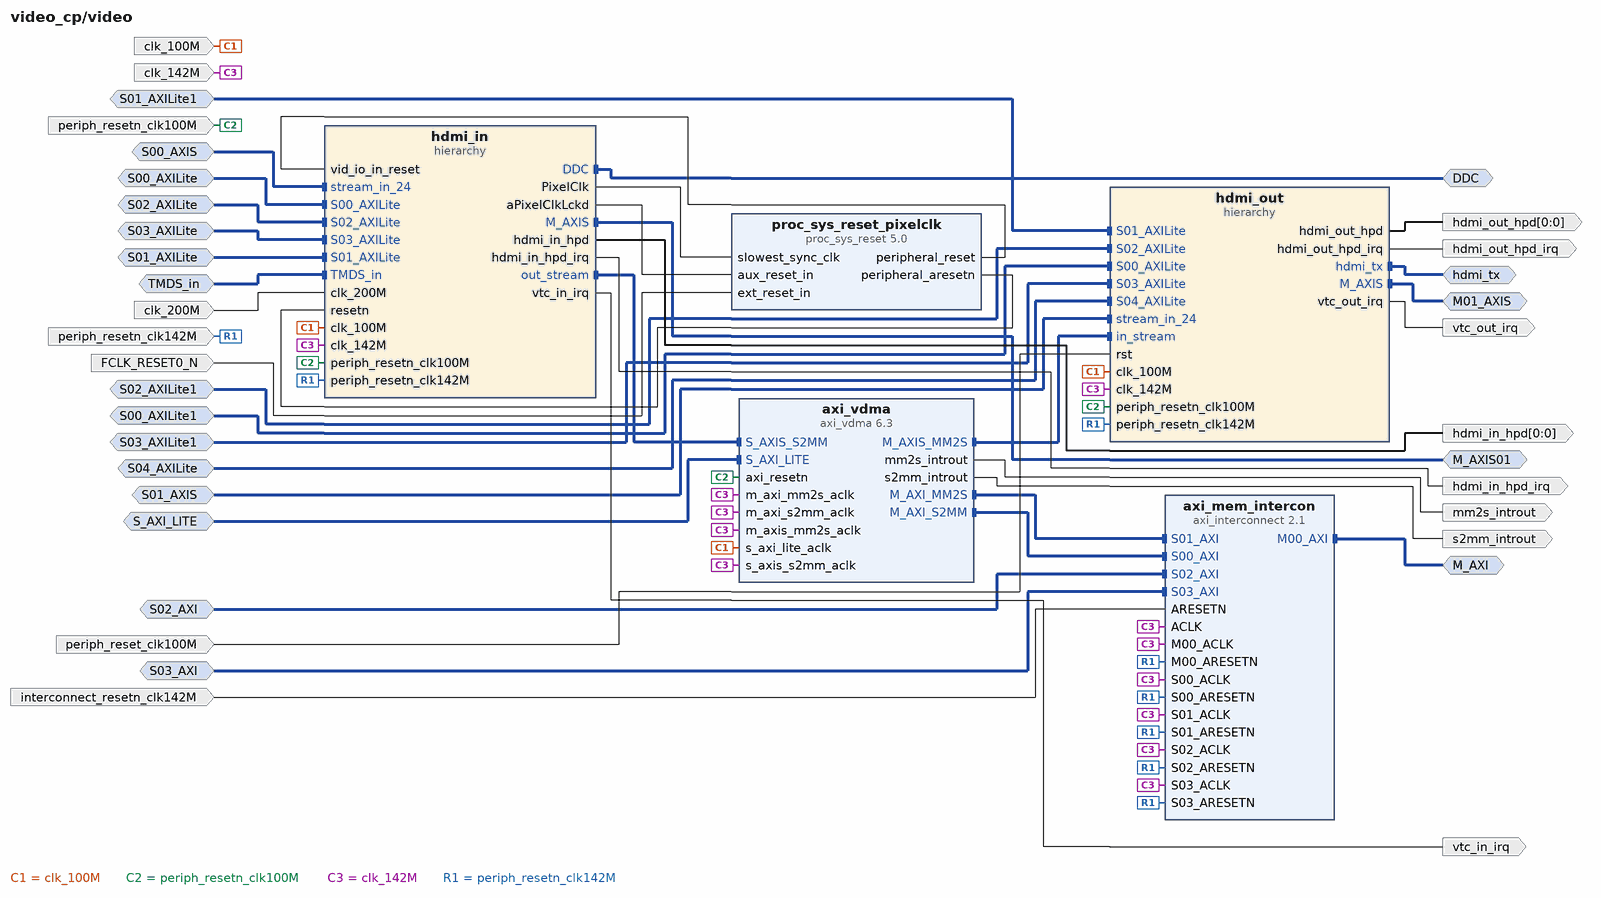
[diagram p3: block diagram inside /video]
create_bd_intf_pin -mode Master -vlnv xilinx.com:interface:iic_rtl:1.0 DDC
create_bd_intf_pin -mode Master -vlnv xilinx.com:interface:axis_rtl:1.0 M01_AXIS
create_bd_intf_pin -mode Master -vlnv xilinx.com:interface:aximm_rtl:1.0 M_AXI
create_bd_intf_pin -mode Master -vlnv xilinx.com:interface:axis_rtl:1.0 M_AXIS01
create_bd_intf_pin -mode Slave -vlnv xilinx.com:interface:aximm_rtl:1.0 S00_AXILite
create_bd_intf_pin -mode Slave -vlnv xilinx.com:interface:aximm_rtl:1.0 S00_AXILite1
create_bd_intf_pin -mode Slave -vlnv xilinx.com:interface:axis_rtl:1.0 S00_AXIS
create_bd_intf_pin -mode Slave -vlnv xilinx.com:interface:aximm_rtl:1.0 S01_AXILite
create_bd_intf_pin -mode Slave -vlnv xilinx.com:interface:aximm_rtl:1.0 S01_AXILite1
create_bd_intf_pin -mode Slave -vlnv xilinx.com:interface:axis_rtl:1.0 S01_AXIS
create_bd_intf_pin -mode Slave -vlnv xilinx.com:interface:aximm_rtl:1.0 S02_AXILite
create_bd_intf_pin -mode Slave -vlnv xilinx.com:interface:aximm_rtl:1.0 S02_AXILite1
create_bd_intf_pin -mode Slave -vlnv xilinx.com:interface:aximm_rtl:1.0 S03_AXILite
create_bd_intf_pin -mode Slave -vlnv xilinx.com:interface:aximm_rtl:1.0 S03_AXILite1
create_bd_intf_pin -mode Slave -vlnv xilinx.com:interface:aximm_rtl:1.0 S04_AXILite
create_bd_intf_pin -mode Slave -vlnv xilinx.com:interface:aximm_rtl:1.0 S_AXI_LITE
create_bd_intf_pin -mode Slave -vlnv digilentinc.com:interface:tmds_rtl:1.0 TMDS_in
create_bd_intf_pin -mode Master -vlnv xilinx.com:interface:hdmi_rtl:2.0 hdmi_tx
create_bd_intf_pin -mode Slave -vlnv xilinx.com:interface:aximm_rtl:1.0 S02_AXI
create_bd_intf_pin -mode Slave -vlnv xilinx.com:interface:aximm_rtl:1.0 S03_AXI
create_bd_pin -dir I -type rst FCLK_RESET0_N
create_bd_pin -dir I -type clk clk_100M
create_bd_pin -dir I clk_142M
create_bd_pin -dir I -type clk clk_200M
create_bd_pin -dir O -from 0 -to 0 hdmi_in_hpd
create_bd_pin -dir O -type intr hdmi_in_hpd_irq
create_bd_pin -dir O -from 0 -to 0 hdmi_out_hpd
create_bd_pin -dir O -type intr hdmi_out_hpd_irq
create_bd_pin -dir I -type rst interconnect_resetn_clk142M
create_bd_pin -dir O -type intr mm2s_introut
create_bd_pin -dir I -type rst periph_reset_clk100M
create_bd_pin -dir I -type rst periph_resetn_clk100M
create_bd_pin -dir I -type rst periph_resetn_clk142M
create_bd_pin -dir O -type intr s2mm_introut
create_bd_pin -dir O -type intr vtc_in_irq
create_bd_pin -dir O -type intr vtc_out_irq

create_bd_cell -type ip -vlnv xilinx.com:ip:axi_interconnect:2.1 axi_mem_intercon
set_property -dict {CONFIG.NUM_MI 1 CONFIG.NUM_SI 4} [get_bd_cells axi_mem_intercon]
create_bd_cell -type ip -vlnv xilinx.com:ip:axi_vdma:6.3 axi_vdma
set_property -dict [list \
  CONFIG.c_m_axi_mm2s_data_width 32 \
  CONFIG.c_m_axis_mm2s_tdata_width 32 \
  CONFIG.c_mm2s_genlock_mode 1 \
  CONFIG.c_mm2s_linebuffer_depth 512 \
  CONFIG.c_mm2s_max_burst_length 32 \
  CONFIG.c_num_fstores 4 \
  CONFIG.c_s2mm_genlock_mode 0 \
  CONFIG.c_s2mm_linebuffer_depth 4096 \
  CONFIG.c_s2mm_max_burst_length 32 \
] [get_bd_cells axi_vdma]
create_bd_cell -type hier hdmi_in
create_bd_cell -type hier hdmi_out
create_bd_cell -type ip -vlnv xilinx.com:ip:proc_sys_reset:5.0 proc_sys_reset_pixelclk

# ---- hierarchy /video/hdmi_in ----
current_bd_instance /video/hdmi_in
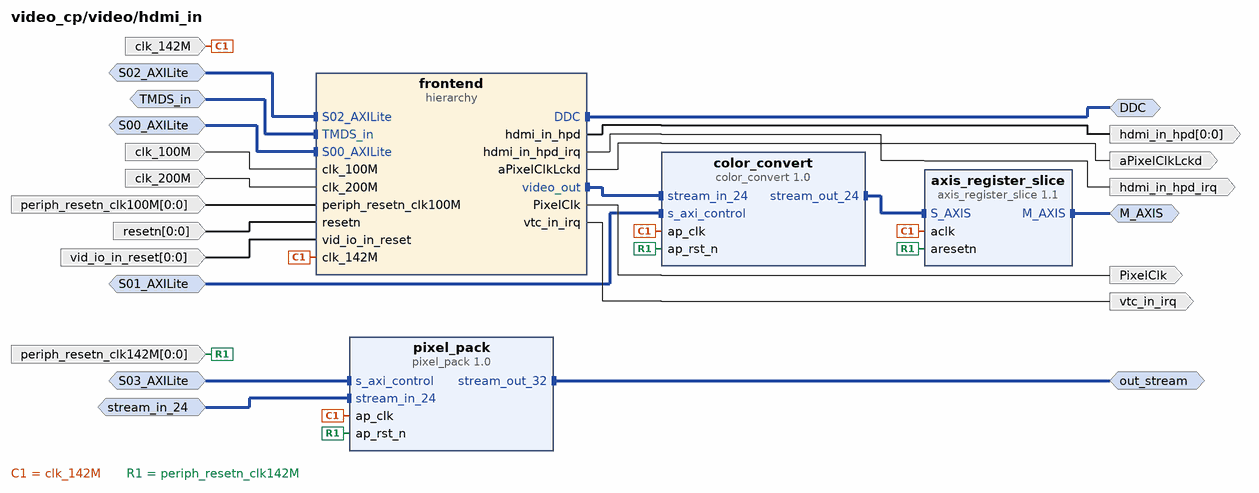
[diagram p4: block diagram inside /video/hdmi_in]
create_bd_intf_pin -mode Master -vlnv xilinx.com:interface:iic_rtl:1.0 DDC
create_bd_intf_pin -mode Master -vlnv xilinx.com:interface:axis_rtl:1.0 M_AXIS
create_bd_intf_pin -mode Slave -vlnv xilinx.com:interface:aximm_rtl:1.0 S00_AXILite
create_bd_intf_pin -mode Slave -vlnv xilinx.com:interface:aximm_rtl:1.0 S01_AXILite
create_bd_intf_pin -mode Slave -vlnv xilinx.com:interface:aximm_rtl:1.0 S02_AXILite
create_bd_intf_pin -mode Slave -vlnv xilinx.com:interface:aximm_rtl:1.0 S03_AXILite
create_bd_intf_pin -mode Slave -vlnv digilentinc.com:interface:tmds_rtl:1.0 TMDS_in
create_bd_intf_pin -mode Master -vlnv xilinx.com:interface:axis_rtl:1.0 out_stream
create_bd_intf_pin -mode Slave -vlnv xilinx.com:interface:axis_rtl:1.0 stream_in_24
create_bd_pin -dir O -type clk PixelClk
create_bd_pin -dir O aPixelClkLckd
create_bd_pin -dir I -type clk clk_100M
create_bd_pin -dir I -type clk clk_142M
create_bd_pin -dir I -type clk clk_200M
create_bd_pin -dir O -from 0 -to 0 hdmi_in_hpd
create_bd_pin -dir O -type intr hdmi_in_hpd_irq
create_bd_pin -dir I -from 0 -to 0 -type rst periph_resetn_clk100M
create_bd_pin -dir I -from 0 -to 0 -type rst periph_resetn_clk142M
create_bd_pin -dir I -from 0 -to 0 -type rst resetn
create_bd_pin -dir I -from 0 -to 0 -type rst vid_io_in_reset
create_bd_pin -dir O -type intr vtc_in_irq

create_bd_cell -type ip -vlnv xilinx.com:ip:axis_register_slice:1.1 axis_register_slice
create_bd_cell -type ip -vlnv xilinx.com:hls:color_convert:1.0 color_convert
create_bd_cell -type hier frontend
create_bd_cell -type ip -vlnv xilinx.com:hls:pixel_pack:1.0 pixel_pack

# ---- hierarchy /video/hdmi_in/frontend ----
current_bd_instance /video/hdmi_in/frontend
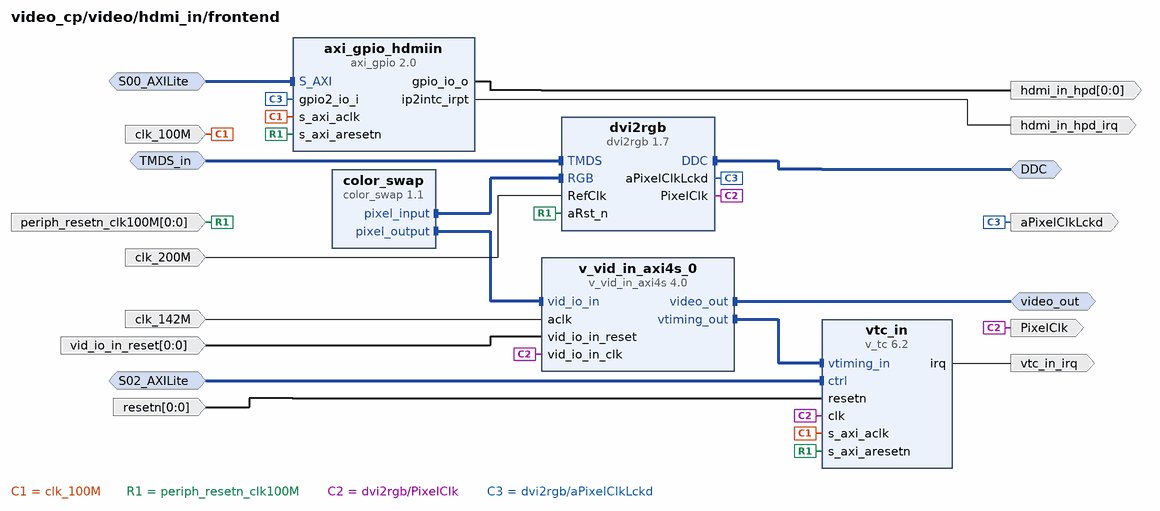
[diagram p5: block diagram inside /video/hdmi_in/frontend]
create_bd_intf_pin -mode Master -vlnv xilinx.com:interface:iic_rtl:1.0 DDC
create_bd_intf_pin -mode Slave -vlnv xilinx.com:interface:aximm_rtl:1.0 S00_AXILite
create_bd_intf_pin -mode Slave -vlnv xilinx.com:interface:aximm_rtl:1.0 S02_AXILite
create_bd_intf_pin -mode Slave -vlnv digilentinc.com:interface:tmds_rtl:1.0 TMDS_in
create_bd_intf_pin -mode Master -vlnv xilinx.com:interface:axis_rtl:1.0 video_out
create_bd_pin -dir O -type clk PixelClk
create_bd_pin -dir O aPixelClkLckd
create_bd_pin -dir I -type clk clk_100M
create_bd_pin -dir I -type clk clk_142M
create_bd_pin -dir I -type clk clk_200M
create_bd_pin -dir O -from 0 -to 0 hdmi_in_hpd
create_bd_pin -dir O -type intr hdmi_in_hpd_irq
create_bd_pin -dir I -from 0 -to 0 -type rst periph_resetn_clk100M
create_bd_pin -dir I -from 0 -to 0 -type rst resetn
create_bd_pin -dir I -from 0 -to 0 -type rst vid_io_in_reset
create_bd_pin -dir O -type intr vtc_in_irq

create_bd_cell -type ip -vlnv xilinx.com:ip:axi_gpio:2.0 axi_gpio_hdmiin
set_property -dict [list \
  CONFIG.C_ALL_INPUTS_2 1 \
  CONFIG.C_ALL_OUTPUTS 1 \
  CONFIG.C_GPIO2_WIDTH 1 \
  CONFIG.C_GPIO_WIDTH 1 \
  CONFIG.C_INTERRUPT_PRESENT 1 \
  CONFIG.C_IS_DUAL 1 \
] [get_bd_cells axi_gpio_hdmiin]
create_bd_cell -type ip -vlnv xilinx.com:user:color_swap:1.1 color_swap
set_property -dict {CONFIG.input_format rbg CONFIG.output_format rgb} [get_bd_cells color_swap]
create_bd_cell -type ip -vlnv digilentinc.com:ip:dvi2rgb:1.7 dvi2rgb
set_property -dict [list \
  CONFIG.kAddBUFG false \
  CONFIG.kClkRange 1 \
  CONFIG.kEdidFileName 720p_edid.data \
  CONFIG.kRstActiveHigh false \
] [get_bd_cells dvi2rgb]
create_bd_cell -type ip -vlnv xilinx.com:ip:v_vid_in_axi4s:4.0 v_vid_in_axi4s_0
set_property -dict {CONFIG.C_ADDR_WIDTH 12 CONFIG.C_HAS_ASYNC_CLK 1} [get_bd_cells v_vid_in_axi4s_0]
create_bd_cell -type ip -vlnv xilinx.com:ip:v_tc:6.2 vtc_in
set_property -dict [list \
  CONFIG.HAS_INTC_IF true \
  CONFIG.enable_generation false \
  CONFIG.horizontal_blank_detection false \
  CONFIG.max_lines_per_frame 2048 \
  CONFIG.vertical_blank_detection false \
] [get_bd_cells vtc_in]

# ---- hierarchy /video/hdmi_out ----
current_bd_instance /video/hdmi_out
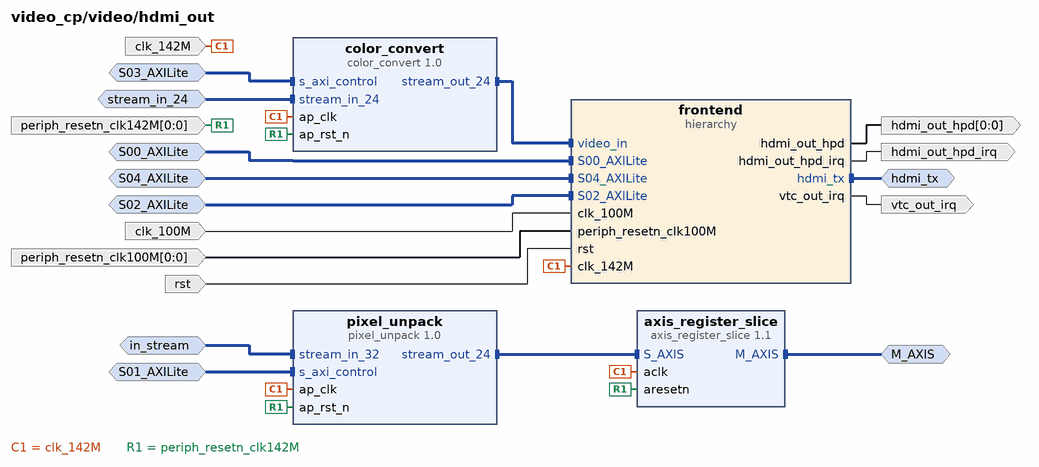
[diagram p6: block diagram inside /video/hdmi_out]
create_bd_intf_pin -mode Master -vlnv xilinx.com:interface:axis_rtl:1.0 M_AXIS
create_bd_intf_pin -mode Slave -vlnv xilinx.com:interface:aximm_rtl:1.0 S00_AXILite
create_bd_intf_pin -mode Slave -vlnv xilinx.com:interface:aximm_rtl:1.0 S01_AXILite
create_bd_intf_pin -mode Slave -vlnv xilinx.com:interface:aximm_rtl:1.0 S02_AXILite
create_bd_intf_pin -mode Slave -vlnv xilinx.com:interface:aximm_rtl:1.0 S03_AXILite
create_bd_intf_pin -mode Slave -vlnv xilinx.com:interface:aximm_rtl:1.0 S04_AXILite
create_bd_intf_pin -mode Master -vlnv xilinx.com:interface:hdmi_rtl:2.0 hdmi_tx
create_bd_intf_pin -mode Slave -vlnv xilinx.com:interface:axis_rtl:1.0 in_stream
create_bd_intf_pin -mode Slave -vlnv xilinx.com:interface:axis_rtl:1.0 stream_in_24
create_bd_pin -dir I -type clk clk_100M
create_bd_pin -dir I -type clk clk_142M
create_bd_pin -dir O -from 0 -to 0 hdmi_out_hpd
create_bd_pin -dir O -type intr hdmi_out_hpd_irq
create_bd_pin -dir I -from 0 -to 0 -type rst periph_resetn_clk100M
create_bd_pin -dir I -from 0 -to 0 -type rst periph_resetn_clk142M
create_bd_pin -dir I -type rst rst
create_bd_pin -dir O -type intr vtc_out_irq

create_bd_cell -type ip -vlnv xilinx.com:ip:axis_register_slice:1.1 axis_register_slice
create_bd_cell -type ip -vlnv xilinx.com:hls:color_convert:1.0 color_convert
create_bd_cell -type hier frontend
create_bd_cell -type ip -vlnv xilinx.com:hls:pixel_unpack:1.0 pixel_unpack

# ---- hierarchy /video/hdmi_out/frontend ----
current_bd_instance /video/hdmi_out/frontend
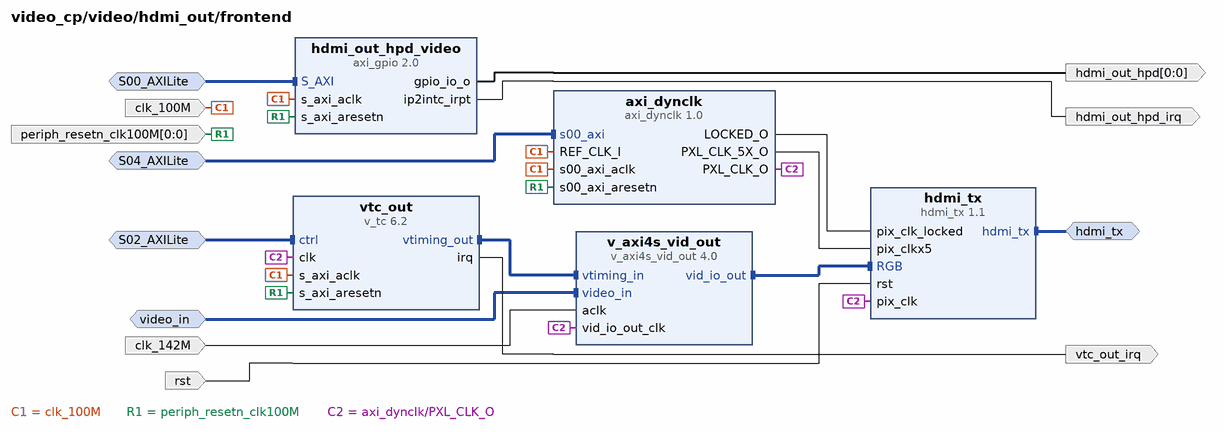
[diagram p7: block diagram inside /video/hdmi_out/frontend]
create_bd_intf_pin -mode Slave -vlnv xilinx.com:interface:aximm_rtl:1.0 S00_AXILite
create_bd_intf_pin -mode Slave -vlnv xilinx.com:interface:aximm_rtl:1.0 S02_AXILite
create_bd_intf_pin -mode Slave -vlnv xilinx.com:interface:aximm_rtl:1.0 S04_AXILite
create_bd_intf_pin -mode Master -vlnv xilinx.com:interface:hdmi_rtl:2.0 hdmi_tx
create_bd_intf_pin -mode Slave -vlnv xilinx.com:interface:axis_rtl:1.0 video_in
create_bd_pin -dir I -type clk clk_100M
create_bd_pin -dir I -type clk clk_142M
create_bd_pin -dir O -from 0 -to 0 hdmi_out_hpd
create_bd_pin -dir O -type intr hdmi_out_hpd_irq
create_bd_pin -dir I -from 0 -to 0 -type rst periph_resetn_clk100M
create_bd_pin -dir I -type rst rst
create_bd_pin -dir O -type intr vtc_out_irq

create_bd_cell -type ip -vlnv digilentinc.com:ip:axi_dynclk:1.0 axi_dynclk
create_bd_cell -type ip -vlnv xilinx.com:ip:axi_gpio:2.0 hdmi_out_hpd_video
set_property -dict {CONFIG.C_ALL_OUTPUTS 1 CONFIG.C_GPIO_WIDTH 1 CONFIG.C_INTERRUPT_PRESENT 1} [get_bd_cells hdmi_out_hpd_video]
create_bd_cell -type ip -vlnv realdigital.org:realdigital:hdmi_tx:1.1 hdmi_tx
set_property -dict {CONFIG.C_DATA_WIDTH 24 CONFIG.MODE DVI} [get_bd_cells hdmi_tx]
create_bd_cell -type ip -vlnv xilinx.com:ip:v_axi4s_vid_out:4.0 v_axi4s_vid_out
set_property -dict [list \
  CONFIG.C_ADDR_WIDTH 11 \
  CONFIG.C_HAS_ASYNC_CLK 1 \
  CONFIG.C_HYSTERESIS_LEVEL 1024 \
  CONFIG.C_VTG_MASTER_SLAVE 1 \
] [get_bd_cells v_axi4s_vid_out]
create_bd_cell -type ip -vlnv xilinx.com:ip:v_tc:6.2 vtc_out
set_property -dict [list \
  CONFIG.GEN_F0_VBLANK_HEND 400 \
  CONFIG.GEN_F0_VBLANK_HSTART 400 \
  CONFIG.GEN_F0_VFRAME_SIZE 525 \
  CONFIG.GEN_F0_VSYNC_HEND 420 \
  CONFIG.GEN_F0_VSYNC_HSTART 420 \
  CONFIG.GEN_F0_VSYNC_VEND 496 \
  CONFIG.GEN_F0_VSYNC_VSTART 493 \
  CONFIG.GEN_HACTIVE_SIZE 800 \
  CONFIG.GEN_HFRAME_SIZE 928 \
  CONFIG.GEN_HSYNC_END 840 \
  CONFIG.GEN_HSYNC_START 840 \
  CONFIG.GEN_VACTIVE_SIZE 480 \
  CONFIG.VIDEO_MODE Custom \
  CONFIG.enable_detection false \
] [get_bd_cells vtc_out]

# ---- connections ----

current_bd_instance /composable
connect_bd_intf_net [get_bd_intf_pins dfx_decouplers/m_axis_pr_1_1] [get_bd_intf_pins pr_1/stream_in1]
connect_bd_intf_net [get_bd_intf_pins axis_switch/M08_AXIS] [get_bd_intf_pins dfx_decouplers/s_axis_dfx_pr_1_0]
connect_bd_intf_net [get_bd_intf_pins axis_switch/M09_AXIS] [get_bd_intf_pins dfx_decouplers/s_axis_dfx_pr_1_1]
connect_bd_intf_net [get_bd_intf_pins dfx_decouplers/s_axi_pr_0_0] [get_bd_intf_pins pr_0/s_axi_control0]
connect_bd_intf_net [get_bd_intf_pins dfx_decouplers/s_axi_pr_0_1] [get_bd_intf_pins pr_0/s_axi_control1]
connect_bd_intf_net [get_bd_intf_pins dfx_decouplers/s_axi_pr_1_0] [get_bd_intf_pins pr_1/s_axi_control0]
connect_bd_intf_net [get_bd_intf_pins dfx_decouplers/s_axi_pr_1_1] [get_bd_intf_pins pr_1/s_axi_control1]
connect_bd_intf_net [get_bd_intf_pins axis_switch/S06_AXIS] [get_bd_intf_pins dfx_decouplers/m_axis_dfx_pr_0_0]
connect_bd_intf_net [get_bd_intf_pins S19_AXI] [get_bd_intf_pins rgb2hsv_accel/s_axi_control]
connect_bd_intf_net [get_bd_intf_pins S14_AXI] [get_bd_intf_pins axis_switch/S_AXI_CTRL]
connect_bd_intf_net [get_bd_intf_pins S23_AXI] [get_bd_intf_pins dfx_decouplers/m_axi_dfx_pr_0_1]
connect_bd_intf_net [get_bd_intf_pins S22_AXI] [get_bd_intf_pins dfx_decouplers/m_axi_dfx_pr_0_0]
connect_bd_intf_net [get_bd_intf_pins axis_dwidth_48_24/S_AXIS] [get_bd_intf_pins axis_fifo_hdmi_out/M_AXIS]
connect_bd_intf_net [get_bd_intf_pins M01_AXIS] [get_bd_intf_pins axis_dwidth_48_24/M_AXIS]
connect_bd_intf_net [get_bd_intf_pins S15_AXI] [get_bd_intf_pins pipeline_control/S_AXI]
connect_bd_intf_net [get_bd_intf_pins axis_dwidth_24_48/M_AXIS] [get_bd_intf_pins axis_fifo_hdmi_out/S_AXIS]
connect_bd_intf_net [get_bd_intf_pins M00_AXIS] [get_bd_intf_pins axis_switch/M00_AXIS]
connect_bd_intf_net [get_bd_intf_pins axis_dwidth_24_48/S_AXIS] [get_bd_intf_pins axis_switch/M01_AXIS]
connect_bd_intf_net [get_bd_intf_pins axis_switch/M02_AXIS] [get_bd_intf_pins rgb2gray_accel/stream_in]
connect_bd_intf_net [get_bd_intf_pins axis_switch/M03_AXIS] [get_bd_intf_pins gray2rgb_accel/stream_in]
connect_bd_intf_net [get_bd_intf_pins axis_switch/M06_AXIS] [get_bd_intf_pins dfx_decouplers/s_axis_dfx_pr_0_0]
connect_bd_intf_net [get_bd_intf_pins axis_switch/M07_AXIS] [get_bd_intf_pins dfx_decouplers/s_axis_dfx_pr_0_1]
connect_bd_intf_net [get_bd_intf_pins axis_switch/S07_AXIS] [get_bd_intf_pins dfx_decouplers/m_axis_dfx_pr_0_1]
connect_bd_intf_net [get_bd_intf_pins axis_switch/S08_AXIS] [get_bd_intf_pins dfx_decouplers/m_axis_dfx_pr_1_0]
connect_bd_intf_net [get_bd_intf_pins axis_switch/S09_AXIS] [get_bd_intf_pins dfx_decouplers/m_axis_dfx_pr_1_1]
connect_bd_intf_net [get_bd_intf_pins axis_switch/S03_AXIS] [get_bd_intf_pins gray2rgb_accel/stream_out]
connect_bd_intf_net [get_bd_intf_pins S00_AXIS] [get_bd_intf_pins axis_switch/S00_AXIS]
connect_bd_intf_net [get_bd_intf_pins S01_AXIS] [get_bd_intf_pins axis_switch/S01_AXIS]
connect_bd_intf_net [get_bd_intf_pins dfx_decouplers/m_axis_pr_0_0] [get_bd_intf_pins pr_0/stream_in0]
connect_bd_intf_net [get_bd_intf_pins dfx_decouplers/m_axis_pr_0_1] [get_bd_intf_pins pr_0/stream_in1]
connect_bd_intf_net [get_bd_intf_pins dfx_decouplers/s_axis_pr_0_0] [get_bd_intf_pins pr_0/stream_out0]
connect_bd_intf_net [get_bd_intf_pins dfx_decouplers/s_axis_pr_0_1] [get_bd_intf_pins pr_0/stream_out1]
connect_bd_intf_net [get_bd_intf_pins dfx_decouplers/m_axis_pr_1_0] [get_bd_intf_pins pr_1/stream_in0]
connect_bd_intf_net [get_bd_intf_pins dfx_decouplers/s_axis_pr_1_0] [get_bd_intf_pins pr_1/stream_out0]
connect_bd_intf_net [get_bd_intf_pins dfx_decouplers/s_axis_pr_1_1] [get_bd_intf_pins pr_1/stream_out1]
connect_bd_intf_net [get_bd_intf_pins axis_switch/S02_AXIS] [get_bd_intf_pins rgb2gray_accel/stream_out]
connect_bd_intf_net [get_bd_intf_pins axis_switch/S04_AXIS] [get_bd_intf_pins rgb2hsv_accel/stream_out]
connect_bd_intf_net [get_bd_intf_pins axis_switch/M04_AXIS] [get_bd_intf_pins rgb2hsv_accel/stream_in]
connect_bd_intf_net [get_bd_intf_pins S24_AXI] [get_bd_intf_pins dfx_decouplers/m_axi_dfx_pr_1_0]
connect_bd_intf_net [get_bd_intf_pins S25_AXI] [get_bd_intf_pins dfx_decouplers/m_axi_dfx_pr_1_1]
connect_bd_intf_net [get_bd_intf_pins S18_AXI] [get_bd_intf_pins rgb2gray_accel/s_axi_control]
connect_bd_intf_net [get_bd_intf_pins S20_AXI] [get_bd_intf_pins gray2rgb_accel/s_axi_control]
connect_bd_net -net aclk_1 [get_bd_pins clk_142M] \
  [get_bd_pins axis_dwidth_24_48/aclk] [get_bd_pins axis_dwidth_48_24/aclk] [get_bd_pins axis_fifo_hdmi_out/s_axis_aclk] \
  [get_bd_pins axis_switch/aclk] [get_bd_pins axis_switch/s_axi_ctrl_aclk] [get_bd_pins dfx_decouplers/clk_142M] \
  [get_bd_pins gray2rgb_accel/ap_clk] [get_bd_pins pipeline_control/s_axi_aclk] \
  [get_bd_pins ps_user_soft_reset/slowest_sync_clk] [get_bd_pins rgb2gray_accel/ap_clk] [get_bd_pins rgb2hsv_accel/ap_clk] \
  [get_bd_pins pr_0/clk_142M] [get_bd_pins pr_1/clk_142M]
connect_bd_net -net axi_control_gpio_io_o [get_bd_pins pipeline_control/gpio_io_o] [get_bd_pins ps_user_soft_reset/aux_reset_in]
connect_bd_net [get_bd_pins dfx_decouplers/dfx_status] [get_bd_pins pipeline_control/gpio2_io_i]
connect_bd_net [get_bd_pins pipeline_control/gpio2_io_o] [get_bd_pins dfx_decouplers/dfx_decouple]
connect_bd_net -net rst_ps7_0_fclk1_peripheral_aresetn [get_bd_pins periph_resetn_clk142M] \
  [get_bd_pins axis_switch/aresetn] [get_bd_pins axis_switch/s_axi_ctrl_aresetn] [get_bd_pins pipeline_control/s_axi_aresetn] \
  [get_bd_pins ps_user_soft_reset/ext_reset_in]
connect_bd_net -net soft_peripheral_aresetn [get_bd_pins ps_user_soft_reset/peripheral_aresetn] \
  [get_bd_pins axis_dwidth_24_48/aresetn] [get_bd_pins axis_dwidth_48_24/aresetn] \
  [get_bd_pins axis_fifo_hdmi_out/s_axis_aresetn] [get_bd_pins dfx_decouplers/periph_resetn_clk142M] \
  [get_bd_pins gray2rgb_accel/ap_rst_n] [get_bd_pins rgb2gray_accel/ap_rst_n] [get_bd_pins rgb2hsv_accel/ap_rst_n] \
  [get_bd_pins pr_0/periph_resetn_clk142M] [get_bd_pins pr_1/periph_resetn_clk142M]

current_bd_instance /composable/dfx_decouplers
connect_bd_intf_net [get_bd_intf_pins m_axi_dfx_pr_0_0] [get_bd_intf_pins dfx_decoupler_pr_0/rp_axi_lite0]
connect_bd_intf_net [get_bd_intf_pins s_axi_pr_0_1] [get_bd_intf_pins dfx_decoupler_pr_0/s_axi_lite1]
connect_bd_intf_net [get_bd_intf_pins s_axi_pr_1_0] [get_bd_intf_pins dfx_decoupler_pr_1/s_axi_lite0]
connect_bd_intf_net [get_bd_intf_pins s_axi_pr_1_1] [get_bd_intf_pins dfx_decoupler_pr_1/s_axi_lite1]
connect_bd_intf_net [get_bd_intf_pins m_axis_pr_0_0] [get_bd_intf_pins pr_0_in0/M_AXIS]
connect_bd_intf_net [get_bd_intf_pins dfx_decoupler_pr_0/rp_out_1] [get_bd_intf_pins pr_0_out1/M_AXIS]
connect_bd_intf_net [get_bd_intf_pins s_axis_pr_0_0] [get_bd_intf_pins pr_0_out0/S_AXIS]
connect_bd_intf_net [get_bd_intf_pins m_axis_pr_0_1] [get_bd_intf_pins pr_0_in1/M_AXIS]
connect_bd_intf_net [get_bd_intf_pins dfx_decoupler_pr_0/rp_out_0] [get_bd_intf_pins pr_0_out0/M_AXIS]
connect_bd_intf_net [get_bd_intf_pins dfx_decoupler_pr_0/rp_in_0] [get_bd_intf_pins pr_0_in0/S_AXIS]
connect_bd_intf_net [get_bd_intf_pins dfx_decoupler_pr_0/rp_in_1] [get_bd_intf_pins pr_0_in1/S_AXIS]
connect_bd_intf_net [get_bd_intf_pins m_axis_dfx_pr_0_0] [get_bd_intf_pins dfx_decoupler_pr_0/s_out_0]
connect_bd_intf_net [get_bd_intf_pins m_axis_dfx_pr_0_1] [get_bd_intf_pins dfx_decoupler_pr_0/s_out_1]
connect_bd_intf_net [get_bd_intf_pins dfx_decoupler_pr_1/rp_in_0] [get_bd_intf_pins pr_1_in0/S_AXIS]
connect_bd_intf_net [get_bd_intf_pins dfx_decoupler_pr_1/rp_in_1] [get_bd_intf_pins pr_1_in1/S_AXIS]
connect_bd_intf_net [get_bd_intf_pins m_axis_dfx_pr_1_0] [get_bd_intf_pins dfx_decoupler_pr_1/s_out_0]
connect_bd_intf_net [get_bd_intf_pins m_axis_dfx_pr_1_1] [get_bd_intf_pins dfx_decoupler_pr_1/s_out_1]
connect_bd_intf_net [get_bd_intf_pins s_axi_pr_0_0] [get_bd_intf_pins dfx_decoupler_pr_0/s_axi_lite0]
connect_bd_intf_net [get_bd_intf_pins s_axis_dfx_pr_0_0] [get_bd_intf_pins dfx_decoupler_pr_0/s_in_0]
connect_bd_intf_net [get_bd_intf_pins m_axi_dfx_pr_0_1] [get_bd_intf_pins dfx_decoupler_pr_0/rp_axi_lite1]
connect_bd_intf_net [get_bd_intf_pins m_axi_dfx_pr_1_1] [get_bd_intf_pins dfx_decoupler_pr_1/rp_axi_lite1]
connect_bd_intf_net [get_bd_intf_pins s_axis_pr_0_1] [get_bd_intf_pins pr_0_out1/S_AXIS]
connect_bd_intf_net [get_bd_intf_pins m_axis_pr_1_0] [get_bd_intf_pins pr_1_in0/M_AXIS]
connect_bd_intf_net [get_bd_intf_pins m_axis_pr_1_1] [get_bd_intf_pins pr_1_in1/M_AXIS]
connect_bd_intf_net [get_bd_intf_pins dfx_decoupler_pr_1/rp_out_0] [get_bd_intf_pins pr_1_out0/M_AXIS]
connect_bd_intf_net [get_bd_intf_pins dfx_decoupler_pr_1/rp_out_1] [get_bd_intf_pins pr_1_out1/M_AXIS]
connect_bd_intf_net [get_bd_intf_pins s_axis_pr_1_0] [get_bd_intf_pins pr_1_out0/S_AXIS]
connect_bd_intf_net [get_bd_intf_pins s_axis_pr_1_1] [get_bd_intf_pins pr_1_out1/S_AXIS]
connect_bd_intf_net [get_bd_intf_pins s_axis_dfx_pr_0_1] [get_bd_intf_pins dfx_decoupler_pr_0/s_in_1]
connect_bd_intf_net [get_bd_intf_pins s_axis_dfx_pr_1_0] [get_bd_intf_pins dfx_decoupler_pr_1/s_in_0]
connect_bd_intf_net [get_bd_intf_pins s_axis_dfx_pr_1_1] [get_bd_intf_pins dfx_decoupler_pr_1/s_in_1]
connect_bd_intf_net [get_bd_intf_pins m_axi_dfx_pr_1_0] [get_bd_intf_pins dfx_decoupler_pr_1/rp_axi_lite0]
connect_bd_net -net dfx_decoupler_0_decouple_status [get_bd_pins dfx_decoupler_pr_0/decouple_status] [get_bd_pins status_xlconcat/In4]
connect_bd_net -net dfx_decoupler_1_decouple_status [get_bd_pins dfx_decoupler_pr_1/decouple_status] [get_bd_pins status_xlconcat/In5]
connect_bd_net -net peripheral_aresetn [get_bd_pins periph_resetn_clk142M] \
  [get_bd_pins pr_0_in0/aresetn] [get_bd_pins pr_0_in1/aresetn] [get_bd_pins pr_0_out0/aresetn] \
  [get_bd_pins pr_0_out1/aresetn] [get_bd_pins pr_1_in0/aresetn] [get_bd_pins pr_1_in1/aresetn] \
  [get_bd_pins pr_1_out0/aresetn] [get_bd_pins pr_1_out1/aresetn]
connect_bd_net -net ps7_0_FCLK_CLK1 [get_bd_pins clk_142M] \
  [get_bd_pins pr_0_in0/aclk] [get_bd_pins pr_0_in1/aclk] [get_bd_pins pr_0_out0/aclk] [get_bd_pins pr_0_out1/aclk] \
  [get_bd_pins pr_1_in0/aclk] [get_bd_pins pr_1_in1/aclk] [get_bd_pins pr_1_out0/aclk] [get_bd_pins pr_1_out1/aclk]
connect_bd_net -net ps7_0_GPIO_O [get_bd_pins dfx_decouple] [get_bd_pins xlslice_pr_0/Din] [get_bd_pins xlslice_pr_1/Din]
connect_bd_net [get_bd_pins status_xlconcat/dout] [get_bd_pins dfx_status]
connect_bd_net [get_bd_pins xlslice_pr_0/Dout] [get_bd_pins dfx_decoupler_pr_0/decouple]
connect_bd_net [get_bd_pins xlslice_pr_1/Dout] [get_bd_pins dfx_decoupler_pr_1/decouple]
